# EAGLE design miniarduinoisp (EAGLE 6.5.0)
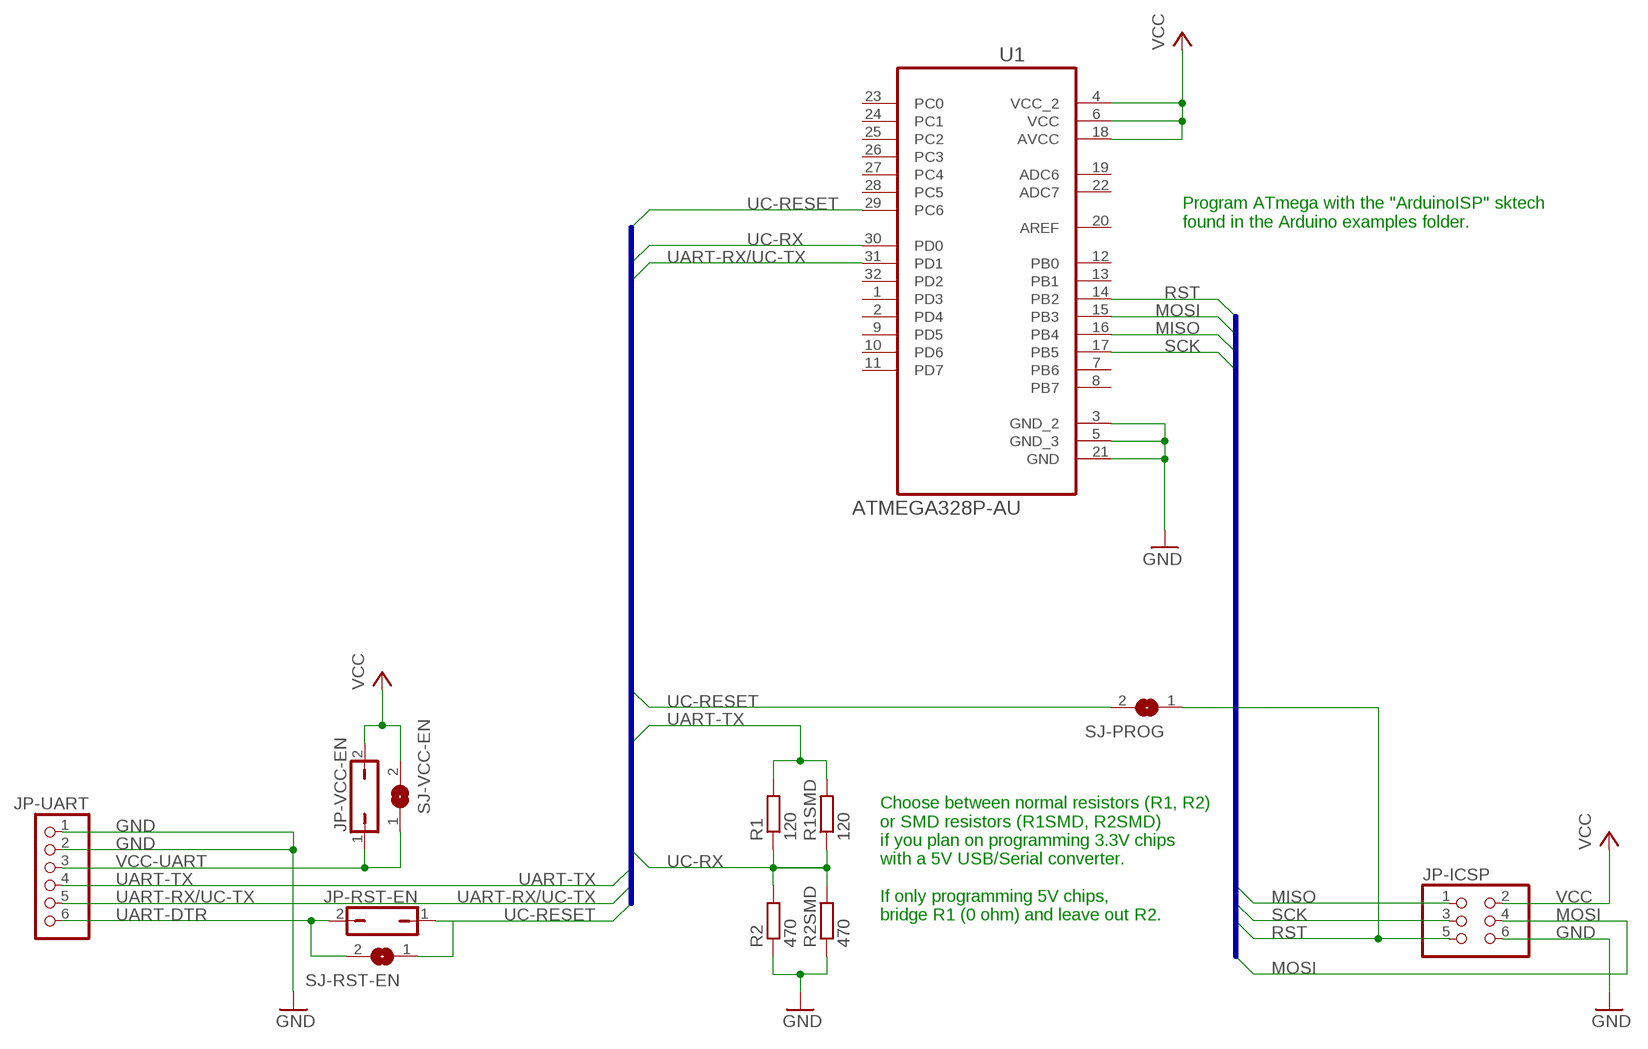
[diagram p0: schematic, sheet 1]

## Parts
JP-ICSP  PINHD-2X3  [2X03]
JP-RST-EN  JP1Q  [JP1]
JP-UART  PINHD-1X6/90  [1X06/90]
JP-VCC-EN  JP1Q  [JP1]
R1  120  R-EU_0204/7  [0204/7]
R1SMD  120  R-EU_R0603  [R0603]
R2  470  R-EU_0204/7  [0204/7]
R2SMD  470  R-EU_R0603  [R0603]
SJ-PROG  SJ  [SJ]
SJ-RST-EN  SJ  [SJ]
SJ-VCC-EN  SJ  [SJ]
U1  ATMEGA328P-AU  [QFP80P900X900X120-32N]

## Nets
GND: JP-ICSP.6 JP-UART.1 JP-UART.2 R2.1 R2SMD.1 U1.3(GND_2) U1.5(GND_3) U1.21(GND)
MISO: JP-ICSP.1 U1.16(PB4)
MOSI: JP-ICSP.4 U1.15(PB3)
RST: JP-ICSP.5 SJ-PROG.1 U1.14(PB2)
SCK: JP-ICSP.3 U1.17(PB5)
UART-DTR: JP-RST-EN.2 JP-UART.6 SJ-RST-EN.2
UART-RX/UC-TX: JP-UART.5 U1.31(PD1)
UART-TX: JP-UART.4 R1.2 R1SMD.2
UC-RESET: JP-RST-EN.1 SJ-PROG.2 SJ-RST-EN.1 U1.29(PC6)
UC-RX: R1.1 R1SMD.1 R2.2 R2SMD.2 U1.30(PD0)
VCC: JP-ICSP.2 JP-VCC-EN.2 SJ-VCC-EN.2 U1.4(VCC_2) U1.6(VCC) U1.18(AVCC)
VCC-UART: JP-UART.3 JP-VCC-EN.1 SJ-VCC-EN.1
Unconnected: U1.1(PD3) U1.2(PD4) U1.7(PB6) U1.8(PB7) U1.9(PD5) U1.10(PD6) U1.11(PD7) U1.12(PB0) U1.13(PB1) U1.19(ADC6) U1.20(AREF) U1.22(ADC7) U1.23(PC0) U1.24(PC1) U1.25(PC2) U1.26(PC3) U1.27(PC4) U1.28(PC5) U1.32(PD2)

## Buses
B$1
B$2

## Notes on the sheet
- Program ATmega with the "ArduinoISP" sktech
  found in the Arduino examples folder.
- Choose between normal resistors (R1, R2)
  or SMD resistors (R1SMD, R2SMD)
  if you plan on programming 3.3V chips
  with a 5V USB/Serial converter.
  
  If only programming 5V chips,
  bridge R1 (0 ohm) and leave out R2.

## Library data of the parts
JP-ICSP = pinhead:PINHD-2X3: PIN HEADER
JP-RST-EN JP-VCC-EN = jumper:JP1Q: JUMPER
JP-UART = pinhead:PINHD-1X6: PIN HEADER
R1 R1SMD R2 R2SMD = rcl:R-EU_: RESISTOR, European symbol
SJ-PROG SJ-RST-EN SJ-VCC-EN = jumper:SJ: SMD solder JUMPER
U1 = Atmel_By_element14_Batch_1-00:ATMEGA328P-AU: 8-bit Microcontroller with In-System Programmable Flash; MPN: ATMEGA328P-AU; OC_FARNELL: 1715486; OC_NEWARK: 14R4631; PACKAGE: TQFP-32; SUPPLIER: Atmel

## Board
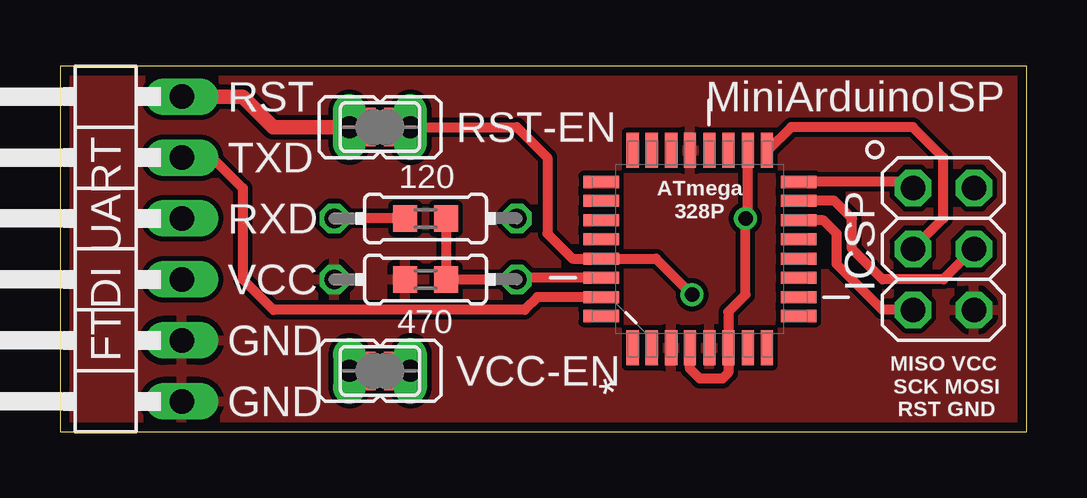
[diagram p1: board, top side]
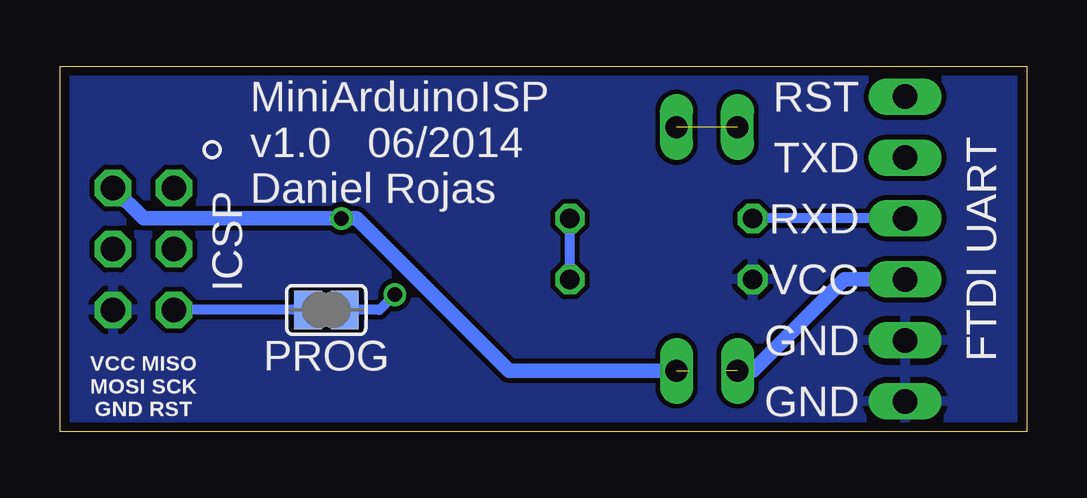
[diagram p2: board, bottom side, seen from below]

Size 40.31 x 15.23 mm. Coordinates in mm from the lower left corner, seen from the top.
Outline: 0,0 40.31,0 40.31,15.23 0,15.23 0,0
Copper layers (1*16): Top 0.0356mm / dielectric 1.5011mm / Bottom 0.0356mm
Design rules "OSHpark_DRC": minimum track width 6mil, minimum drill 13mil, track to track 6mil, track to pad 6mil, pad to pad 6mil, via to via 6mil, smd to smd 6mil, copper to edge 15mil, drill to drill 6mil, minimum pad ring 7mil, minimum via ring 7mil, stop-mask expansion 3mil, vias tented up to drill 0mil, thermal gap 10mil

### Footprints (pad centres in the part's own frame; a part is rotated, then mirrored left to right if it is on the bottom)
2X03 = drill 1.016 octagon: 1 -2.54,-1.27; 2 -2.54,1.27; 3 0,-1.27; 4 0,1.27; 5 2.54,-1.27; 6 2.54,1.27
JP1 = drill 0.914 long: 1 0,-1.27; 2 0,1.27
1X06/90 = drill 1.016 long: 1 -6.35,-3.81; 2 -3.81,-3.81; 3 -1.27,-3.81; 4 1.27,-3.81; 5 3.81,-3.81; 6 6.35,-3.81
0204/7 = drill 0.813 octagon: 1 -3.81,0; 2 3.81,0
R0603 = smd 1 x 1.1: 1 -0.85,0; 2 0.85,0
SJ = smd 1.168 x 1.6: 1 -0.762,0; 2 0.762,0
QFP80P900X900X120-32N = smd 1.473 x 0.508: 1 -4.115,2.794; 2 -4.115,2.007; 3 -4.115,1.194; 4 -4.115,0.406; 5 -4.115,-0.406; 6 -4.115,-1.194; 7 -4.115,-2.007; 8 -4.115,-2.794; 17 4.115,-2.794; 18 4.115,-2.007; 19 4.115,-1.194; 20 4.115,-0.406; 21 4.115,0.406; 22 4.115,1.194; 23 4.115,2.007; 24 4.115,2.794 | smd 0.508 x 1.473: 9 -2.794,-4.115; 10 -2.007,-4.115; 11 -1.194,-4.115; 12 -0.406,-4.115; 13 0.406,-4.115; 14 1.194,-4.115; 15 2.007,-4.115; 16 2.794,-4.115; 25 2.794,4.115; 26 2.007,4.115; 27 1.194,4.115; 28 0.406,4.115; 29 -0.406,4.115; 30 -1.194,4.115; 31 -2.007,4.115; 32 -2.794,4.115

### Placement (x,y rotation side)
JP-ICSP  36.83,7.62 270 top
JP-RST-EN  13.34,12.7 90 top
JP-UART  1.27,7.62 90 top
JP-VCC-EN  13.34,2.54 270 top
R1  15.24,8.89 180 top
R1SMD  15.24,8.89 180 top
R2  15.24,6.35 0 top
R2SMD  15.24,6.35 0 top
SJ-PROG  29.21,5.08 0 bottom
SJ-RST-EN  13.34,12.7 0 top
SJ-VCC-EN  13.34,2.54 0 top
U1  26.67,7.62 90 top

### Tracks (layer width: path | path; a pad name or v marks a point on that pad's centre or on a via)
GND
  pour Bottom (isolate 0.203): 0,15.24 40.64,15.24 40.64,0 0,0
  pour Top (isolate 0.203): 0,15.24 40.64,15.24 40.64,0 0,0
MISO
  Top 0.406: JP-ICSP.1 35.31,10.41 U1.16
MOSI
  Top 0.406: JP-ICSP.4 36.83,6.35 34.29,6.35 33.02,7.62 33.02,8.89 32.28,9.63 U1.15
RST
  Top 0.406: JP-ICSP.5 34.29,5.08 32.38,6.99 32.38,8.26 31.83,8.81 U1.14
  Bottom 0.406: SJ-PROG.1 JP-ICSP.5
SCK
  Top 0.406: JP-ICSP.3 36.83,8.89 36.83,11.43 35.56,12.7 30.48,12.7 29.52,11.73 U1.17
UART-DTR  (1 unrouted)
  Top 0.61: JP-UART.6 7.62,13.97 8.89,12.7 JP-RST-EN.2
UART-RX/UC-TX
  Top 0.406: JP-UART.5 6.35,11.43 7.62,10.16 7.62,6.35 8.89,5.08 19.37,5.08 19.9,5.61 U1.31
UART-TX
  Top 0.406: R1SMD.2 R1.2
  Bottom 0.406: JP-UART.4 R1.2
UC-RESET  (via drill 0.6)  (1 unrouted)
  Top 0.406: JP-RST-EN.1 19.05,12.7 20.32,11.43 20.32,8.26 21.36,7.21 U1.29 24.85,7.21 v26.35,5.71
  Bottom 0.406: v26.35,5.71 26.99,5.08 SJ-PROG.2
UC-RX
  Top 0.406: U1.30 18.81,6.43 R2.2 R2SMD.2 R1SMD.1
  Bottom 0.406: R2.2 R1.1
VCC  (via drill 0.6)  (1 unrouted)
  Top 0.406: U1.4 26.26,2.63 26.67,2.22 27.62,2.22 27.86,2.46 U1.6 27.86,5 28.57,5.71 v28.57,8.89 28.68,8.89 U1.18
  Bottom 0.61: JP-ICSP.2 36.83,8.89 v28.57,8.89 27.94,8.89 21.59,2.54 JP-VCC-EN.2
VCC-UART  (1 unrouted)
  Bottom 0.61: JP-UART.3 7.62,6.35 11.43,2.54 JP-VCC-EN.1

### Text on the board
tPlace: RST | MiniArduinoISP | RST-EN | TXD | RXD | ATmega / 328P | FTDI UART | ICSP | VCC | GND | VCC-EN | GND | MISO VCC / SCK MOSI / RST GND
bPlace: RST | MiniArduinoISP | v1.0 06/2014 | TXD | Daniel Rojas | RXD | FTDI UART | ICSP | VCC | GND | PROG | GND | VCC MISO / MOSI SCK / GND RST